# EAGLE schematic nixie_schema (EAGLE 8.2.1)

## Sheet 1 of 5: Tube Drivers
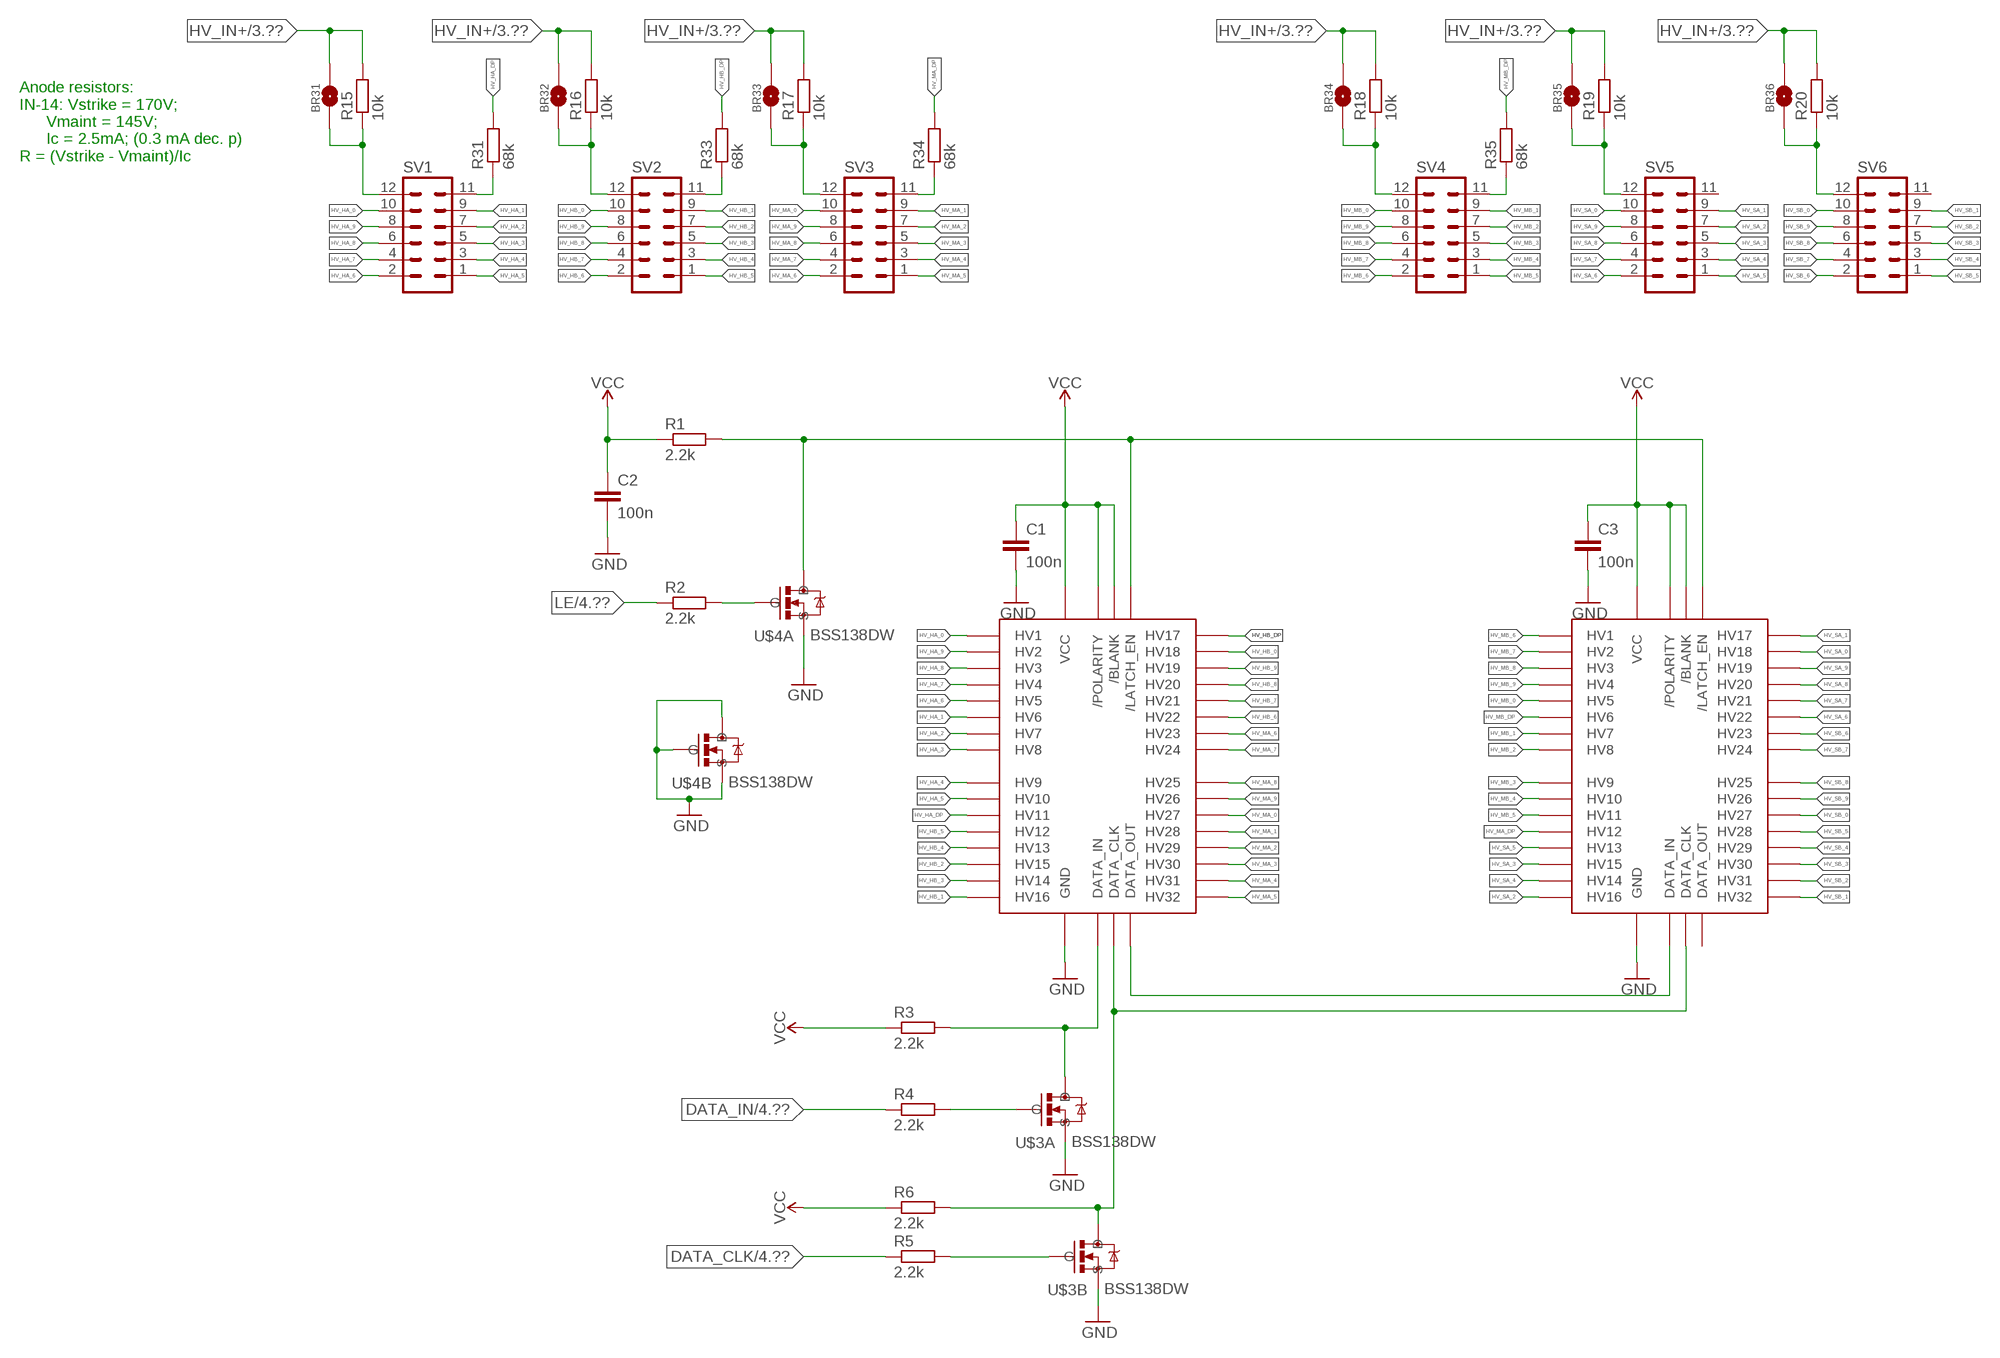
[diagram p0: schematic, sheet 1]

### Parts
BR31  HV_SOLDER_BRIDGE  [HV_SOLDER_BRIDGE]
BR32  HV_SOLDER_BRIDGE  [HV_SOLDER_BRIDGE]
BR33  HV_SOLDER_BRIDGE  [HV_SOLDER_BRIDGE]
BR34  HV_SOLDER_BRIDGE  [HV_SOLDER_BRIDGE]
BR35  HV_SOLDER_BRIDGE  [HV_SOLDER_BRIDGE]
BR36  HV_SOLDER_BRIDGE  [HV_SOLDER_BRIDGE]
C1  100n  C-EUC0805  [C0805]
C2  100n  C-EUC0805  [C0805]
C3  100n  C-EUC0805  [C0805]
R1  2.2k  R-EU_R0603  [R0603]
R2  2.2k  R-EU_R0603  [R0603]
R3  2.2k  R-EU_R0603  [R0603]
R4  2.2k  R-EU_R0603  [R0603]
R5  2.2k  R-EU_R0603  [R0603]
R6  2.2k  R-EU_R0603  [R0603]
R15  10k  R-EU_R0603  [R0603]
R16  10k  R-EU_R0603  [R0603]
R17  10k  R-EU_R0603  [R0603]
R18  10k  R-EU_R0603  [R0603]
R19  10k  R-EU_R0603  [R0603]
R20  10k  R-EU_R0603  [R0603]
R31  68k  R-EU_R0603  [R0603]
R33  68k  R-EU_R0603  [R0603]
R34  68k  R-EU_R0603  [R0603]
R35  68k  R-EU_R0603  [R0603]
SV1  MA06-2  [MA06-2]
SV2  MA06-2  [MA06-2]
SV3  MA06-2  [MA06-2]
SV4  MA06-2  [MA06-2]
SV5  MA06-2  [MA06-2]
SV6  MA06-2  [MA06-2]
U$1  HV5522  [CQFP-44]
U$2  HV5522  [CQFP-44]
U$3  BSS138DW  [SOT-363]
U$4  BSS138DW  [SOT-363]

### Nets
DATA_CLK: R5.1 ; also sheet 4
DATA_IN: R4.1 ; also sheet 4
GND: C1.2 C2.2 C3.2 U$1.24(GND) U$1.25(GND) U$1.26(GND) U$1.29(GND) U$1.34(GND) U$2.24(GND) U$2.25(GND) U$2.26(GND) U$2.29(GND) U$2.34(GND) U$3.1(A:S) U$3.4(B:S) U$4.1(A:S) U$4.3(B:D) U$4.4(B:S) U$4.5(B:G) ; also sheet 2,3,4,5
HV_DATA_CLK: R6.2 U$1.28(DATA_CLK) U$2.28(DATA_CLK) U$3.3(B:D)
HV_DATA_IN: R3.2 U$1.32(DATA_IN) U$3.6(A:D)
HV_DATA_OUT: U$1.23(DATA_OUT) U$2.32(DATA_IN)
HV_HA_0: SV1.10 U$1.35(HV1)
HV_HA_1: SV1.9 U$1.40(HV6)
HV_HA_2: SV1.7 U$1.41(HV7)
HV_HA_3: SV1.5 U$1.42(HV8)
HV_HA_4: SV1.3 U$1.43(HV9)
HV_HA_5: SV1.1 U$1.44(HV10)
HV_HA_6: SV1.2 U$1.39(HV5)
HV_HA_7: SV1.4 U$1.38(HV4)
HV_HA_8: SV1.6 U$1.37(HV3)
HV_HA_9: SV1.8 U$1.36(HV2)
HV_HA_DP: R31.2 U$1.1(HV11)
HV_HB_0: SV2.10 U$1.8(HV18)
HV_HB_1: SV2.9 U$1.6(HV16)
HV_HB_2: SV2.7 U$1.5(HV15)
HV_HB_3: SV2.5 U$1.4(HV14)
HV_HB_4: SV2.3 U$1.3(HV13)
HV_HB_5: SV2.1 U$1.2(HV12)
HV_HB_6: SV2.2 U$1.12(HV22)
HV_HB_7: SV2.4 U$1.11(HV21)
HV_HB_8: SV2.6 U$1.10(HV20)
HV_HB_9: SV2.8 U$1.9(HV19)
HV_HB_DP: R33.2 U$1.7(HV17)
HV_IN+ [HV]: BR31.P$2 BR32.P$2 BR33.P$2 BR34.P$2 BR35.P$2 BR36.P$2 R15.2 R16.2 R17.2 R18.2 R19.2 R20.2 ; also sheet 3
HV_LE: R1.2 U$1.31(/LATCH_EN) U$2.31(/LATCH_EN) U$4.6(A:D)
HV_MA_0: SV3.10 U$1.17(HV27)
HV_MA_1: SV3.9 U$1.18(HV28)
HV_MA_2: SV3.7 U$1.19(HV29)
HV_MA_3: SV3.5 U$1.20(HV30)
HV_MA_4: SV3.3 U$1.21(HV31)
HV_MA_5: SV3.1 U$1.22(HV32)
HV_MA_6: SV3.2 U$1.13(HV23)
HV_MA_7: SV3.4 U$1.14(HV24)
HV_MA_8: SV3.6 U$1.15(HV25)
HV_MA_9: SV3.8 U$1.16(HV26)
HV_MA_DP: R34.2 U$2.2(HV12)
HV_MB_0: SV4.10 U$2.39(HV5)
HV_MB_1: SV4.9 U$2.41(HV7)
HV_MB_2: SV4.7 U$2.42(HV8)
HV_MB_3: SV4.5 U$2.43(HV9)
HV_MB_4: SV4.3 U$2.44(HV10)
HV_MB_5: SV4.1 U$2.1(HV11)
HV_MB_6: SV4.2 U$2.35(HV1)
HV_MB_7: SV4.4 U$2.36(HV2)
HV_MB_8: SV4.6 U$2.37(HV3)
HV_MB_9: SV4.8 U$2.38(HV4)
HV_MB_DP: R35.2 U$2.40(HV6)
HV_SA_0: SV5.10 U$2.8(HV18)
HV_SA_1: SV5.9 U$2.7(HV17)
HV_SA_2: SV5.7 U$2.6(HV16)
HV_SA_3: SV5.5 U$2.5(HV15)
HV_SA_4: SV5.3 U$2.4(HV14)
HV_SA_5: SV5.1 U$2.3(HV13)
HV_SA_6: SV5.2 U$2.12(HV22)
HV_SA_7: SV5.4 U$2.11(HV21)
HV_SA_8: SV5.6 U$2.10(HV20)
HV_SA_9: SV5.8 U$2.9(HV19)
HV_SB_0: SV6.10 U$2.17(HV27)
HV_SB_1: SV6.9 U$2.22(HV32)
HV_SB_2: SV6.7 U$2.21(HV31)
HV_SB_3: SV6.5 U$2.20(HV30)
HV_SB_4: SV6.3 U$2.19(HV29)
HV_SB_5: SV6.1 U$2.18(HV28)
HV_SB_6: SV6.2 U$2.13(HV23)
HV_SB_7: SV6.4 U$2.14(HV24)
HV_SB_8: SV6.6 U$2.15(HV25)
HV_SB_9: SV6.8 U$2.16(HV26)
LE: R2.1 ; also sheet 4
N$3: R2.2 U$4.2(A:G)
N$4: R4.2 U$3.2(A:G)
N$8 [HV]: BR34.P$1 R18.1 SV4.12
N$9: R5.2 U$3.5(B:G)
N$11 [HV]: BR33.P$1 R17.1 SV3.12
N$89 [HV]: BR31.P$1 R15.1 SV1.12
N$90 [HV]: BR32.P$1 R16.1 SV2.12
N$91 [HV]: BR36.P$1 R20.1 SV6.12
N$92 [HV]: BR35.P$1 R19.1 SV5.12
N$106: R31.1 SV1.11
N$108: R33.1 SV2.11
N$110: R34.1 SV3.11
N$112: R35.1 SV4.11
VCC [Power]: C1.1 C2.1 C3.1 R1.1 R3.1 R6.1 U$1.27(/POLARITY) U$1.30(VCC) U$1.33(/BLANK) U$2.27(/POLARITY) U$2.30(VCC) U$2.33(/BLANK) ; also sheet 2,3
Unconnected: SV5.11 SV6.11 U$2.23(DATA_OUT)

### Notes on the sheet
- Anode resistors:
  IN-14: Vstrike = 170V;
        Vmaint = 145V;
        Ic = 2.5mA; (0.3 mA dec. p)
  R = (Vstrike - Vmaint)/Ic

## Sheet 2 of 5: Low Voltage Power Supply
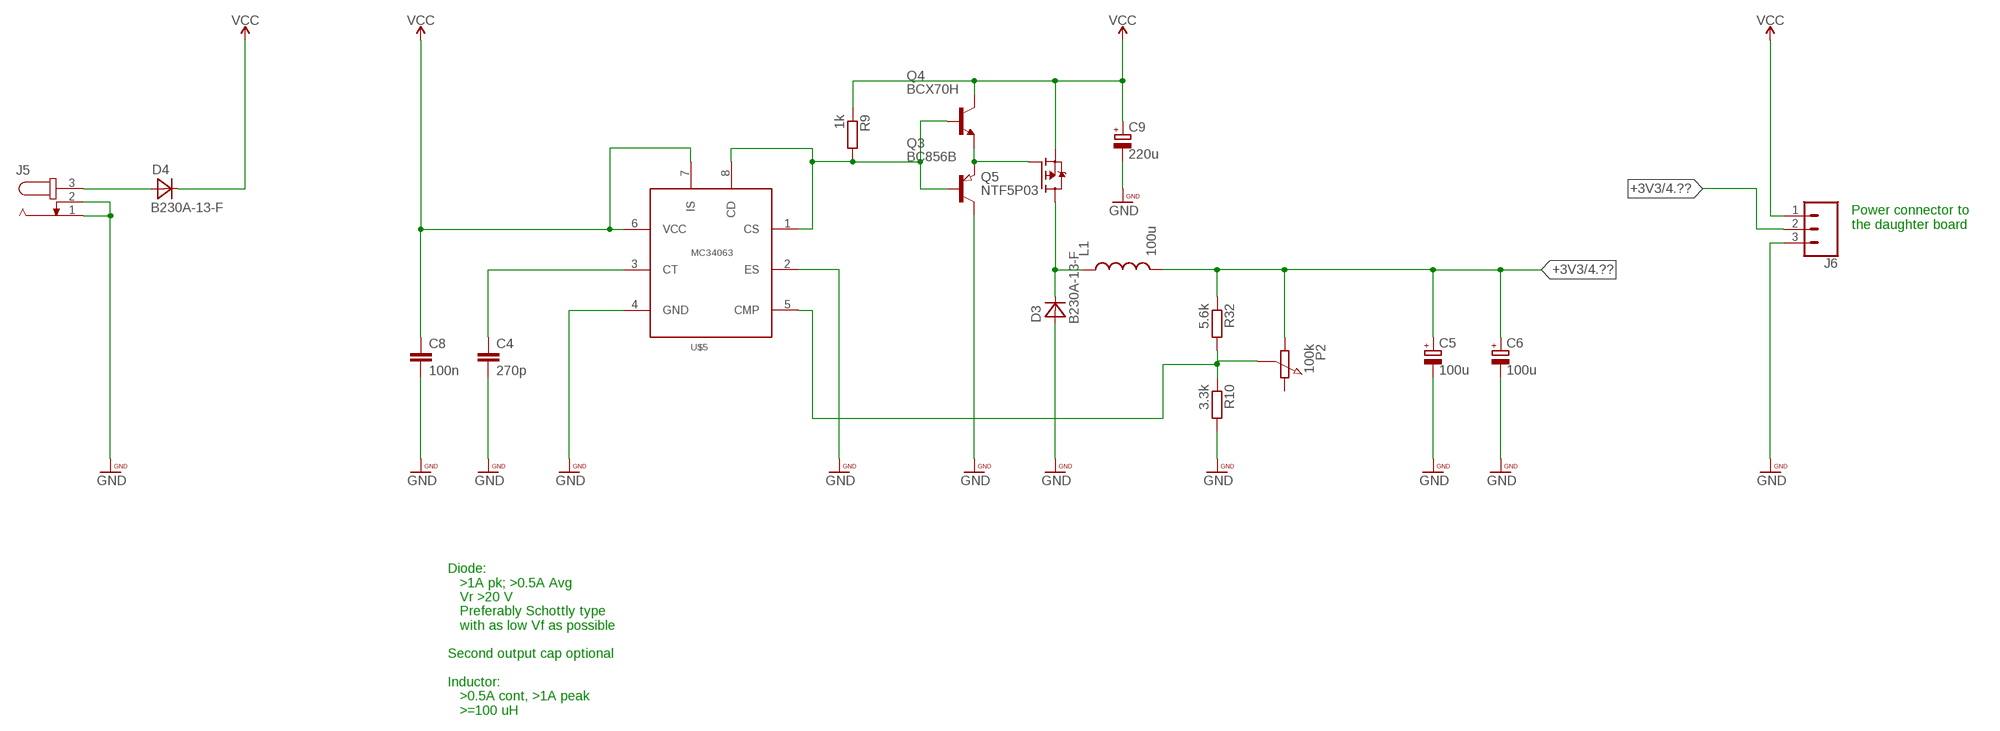
[diagram p1: schematic, sheet 2]

### Parts
C4  270p  C-EUC0805  [C0805]
C5  100u  CPOL-EU153CLV-1014  [153CLV-1014]
C6  100u  CPOL-EU153CLV-1014  [153CLV-1014]
C8  100n  C-EUC0805  [C0805]
C9  220u  CPOL-EU153CLV-1014  [153CLV-1014]
D3  B230A-13-F  [SMA/SMB]
D4  B230A-13-F  [SMA/SMB]
J5  JACK-PLUG0  [SPC4077]
J6  CONN_03  [1X03]
L1  100u  HM78D-128151KLFTR  [INDUCTOR_PACKAGE]
P2  100k  UNIVERSAL-POTENTIOMETER_SMD  [UNI_POT_SMD]
Q3  BC856B  [SOT23]
Q4  BCX70H  [SOT23]
Q5  NTF5P03  [SOT223]
R9  1k  R-EU_R0603  [R0603]
R10  3.3k  R-EU_R0603  [R0603]
R32  5.6k  R-EU_R0603  [R0603]
U$5  MC34063  [SOIC08]

### Nets
+3V3 [medium power]: C5.+ C6.+ J6.2 L1.P$2 P2.P$1(A) R32.1 ; also sheet 4
GND: C4.2 C5.- C6.- C8.2 C9.- D3.A J5.1 J5.2 J6.3 Q3.3(C) R10.2 U$5.2(ES) U$5.4(GND) ; also sheet 1,3,4,5
N$5: Q3.1(B) Q4.1(B) R9.2 U$5.1(CS) U$5.8(CD)
N$12: C4.1 U$5.3(CT)
N$13 [medium power]: D3.C L1.P$1 Q5.2(D) Q5.4(D)
N$93 [Power]: D4.A J5.3
N$102: Q3.2(E) Q4.2(E) Q5.1(G)
N$103: P2.P$2(WIPER) R10.1 R32.2 U$5.5(CMP)
VCC [Power]: C8.1 C9.+ D4.C J6.1 Q4.3(C) Q5.3(S) R9.1 U$5.6(VCC) U$5.7(IS) ; also sheet 1,3
Unconnected: P2.P$3(E)

### Notes on the sheet
- Power connector to
  the daughter board
- Diode:
     >1A pk; >0.5A Avg
     Vr >20 V
     Preferably Schottly type
     with as low Vf as possible
  
  Second output cap optional
  
  Inductor:
     >0.5A cont, >1A peak
     >=100 uH

## Sheet 3 of 5: High Voltage Power Supply
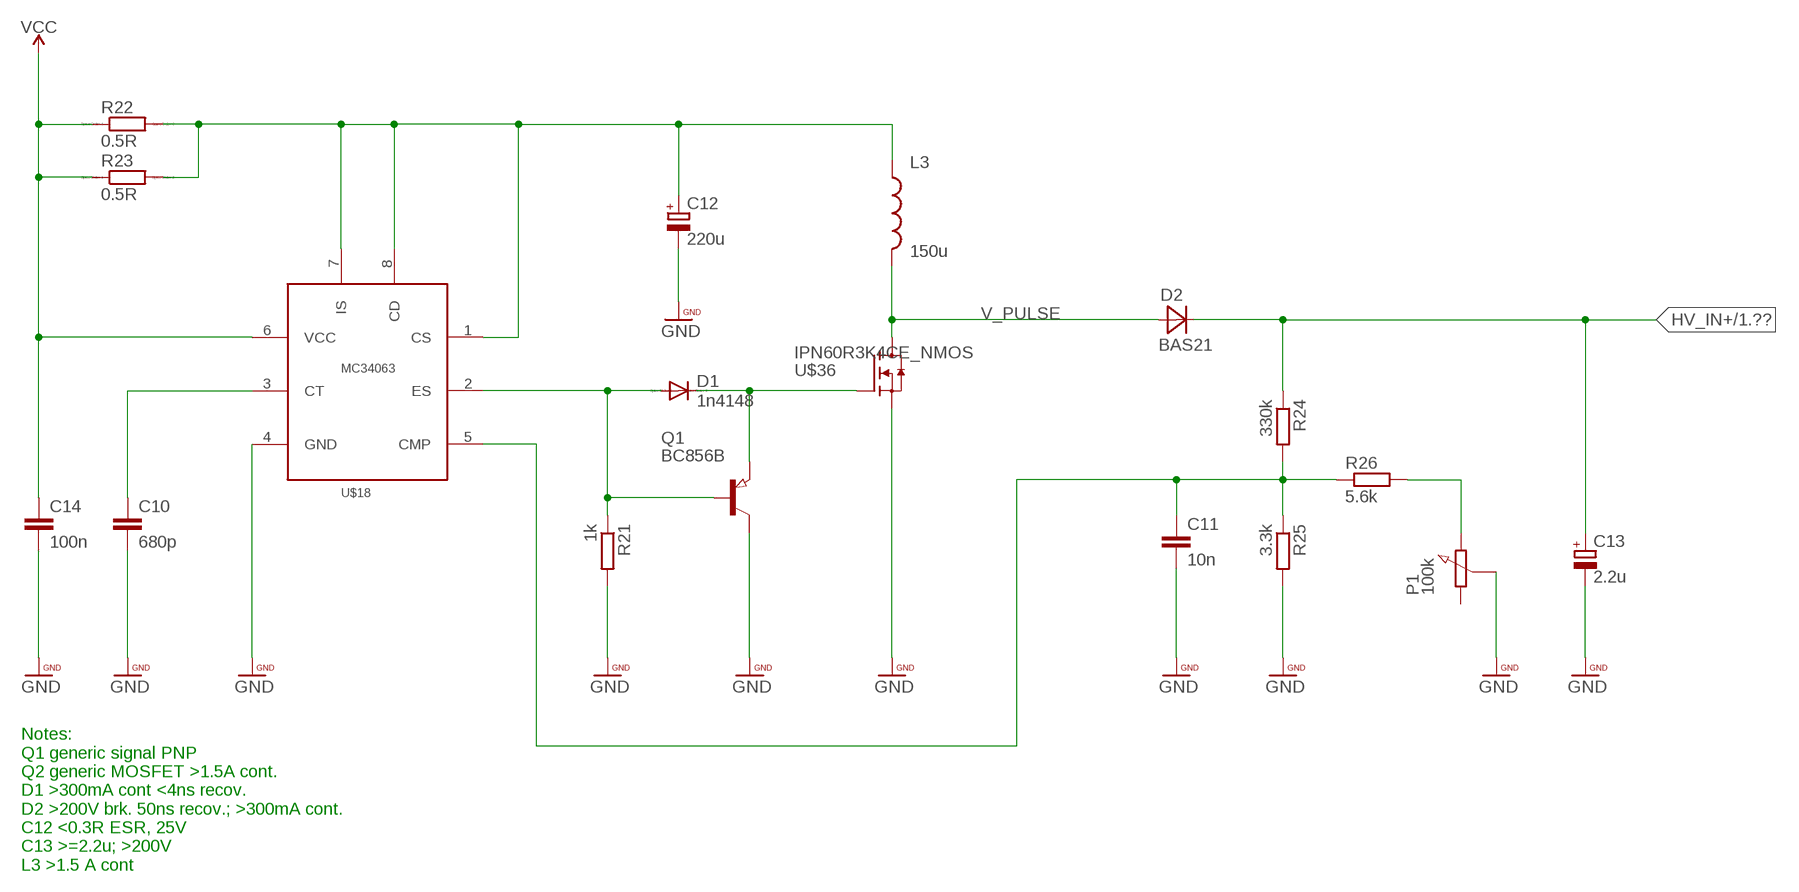
[diagram p2: schematic, sheet 3]

### Parts
C10  680p  C-EUC0805  [C0805]
C11  10n  C-EUC0805  [C0805]
C12  220u  CPOL-EU153CLV-1014  [153CLV-1014]
C13  2.2u  CPOL-EU153CLV-1014  [153CLV-1014]
C14  100n  C-EUC0805  [C0805]
D1  1n4148  DIODE-SOD123  [SOD123]
D2  BAS21  [SOT23]
L3  150u  HM78D-128151KLFTR  [INDUCTOR_PACKAGE]
P1  100k  UNIVERSAL-POTENTIOMETER_SMD  [UNI_POT_SMD]
Q1  BC856B  [SOT23]
R21  1k  R-EU_R0603  [R0603]
R22  0.5R  RR1210  [R1210]
R23  0.5R  RR1210  [R1210]
R24  330k  R-EU_R0603  [R0603]
R25  3.3k  R-EU_R0603  [R0603]
R26  5.6k  R-EU_R0603  [R0603]
U$18  MC34063  [SOIC08]
U$36  IPN60R3K4CE_NMOS  [SOT223]

### Nets
GND: C10.2 C11.2 C12.- C13.- C14.2 P1.P$2(WIPER) Q1.3(C) R21.2 R25.2 U$18.4(GND) U$36.3(S) ; also sheet 1,2,4,5
HV_IN+ [HV]: C13.+ D2.3(C) R24.1 ; also sheet 1
N$74: C10.1 U$18.3(CT)
N$85: D1.A Q1.1(B) R21.1 U$18.2(ES)
N$87 [Power]: C12.+ L3.P$1 R22.2 R23.2 U$18.1(CS) U$18.7(IS) U$18.8(CD)
N$95: D1.C Q1.2(E) U$36.1(G)
N$96: C11.1 R24.2 R25.1 R26.1 U$18.5(CMP)
N$97: P1.P$3(E) R26.2
V_PULSE [HV]: D2.1(A) L3.P$2 U$36.2(D) U$36.4(D)
VCC [Power]: C14.1 R22.1 R23.1 U$18.6(VCC) ; also sheet 1,2
Unconnected: P1.P$1(A)

### Notes on the sheet
- Notes:
  Q1 generic signal PNP
  Q2 generic MOSFET >1.5A cont.
  D1 >300mA cont <4ns recov.
  D2 >200V brk. 50ns recov.; >300mA cont.
  C12 <0.3R ESR, 25V
  C13 >=2.2u; >200V
  L3 >1.5 A cont

## Sheet 4 of 5: ESP8266 Controller
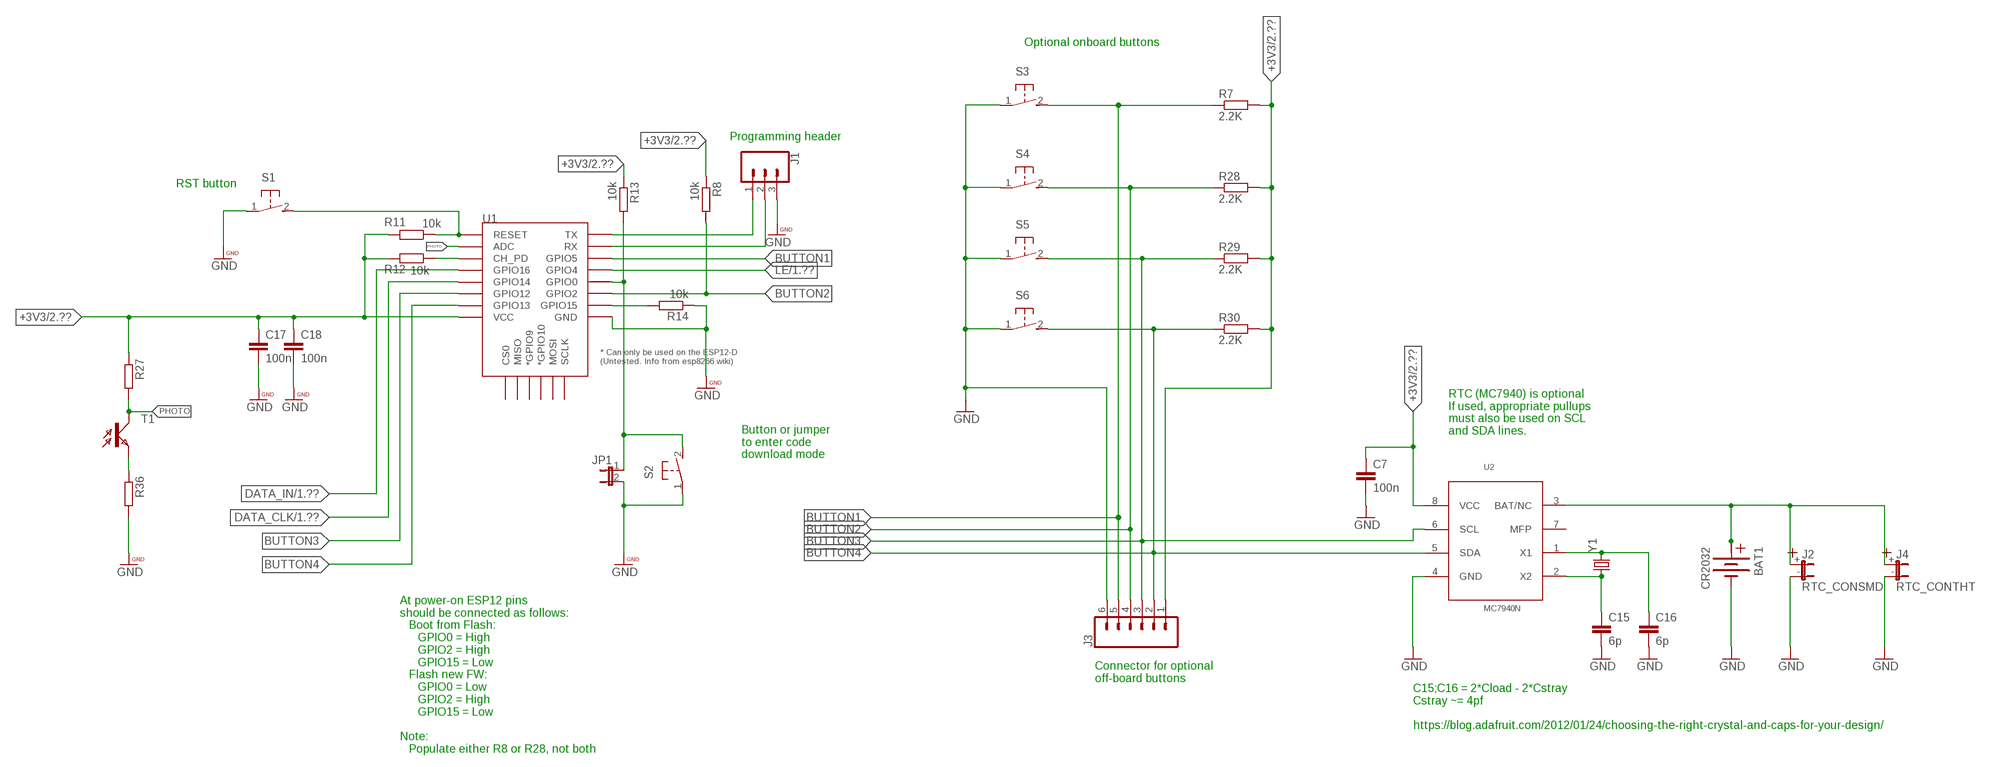
[diagram p3: schematic, sheet 4]

### Parts
BAT1  CR2032  [CR2032]
C7  100n  C-EUC0805  [C0805]
C15  6p  C-EUC0805  [C0805]
C16  6p  C-EUC0805  [C0805]
C17  100n  C-EUC0805  [C0805]
C18  100n  C-EUC0805  [C0805]
J1  CONN_03  [1X03]
J2  RTC_CONSMD  [PICOBLADE_SMD_2]
J3  CONN_06NO_SILK_FEMALE_PTH  [1X06_NO_SILK]
J4  RTC_CONTHT  [PICOBLADE_THT_2]
JP1  JUMPER2  [JUMPER2]
R7  2.2K  R-EU_R0603  [R0603]
R8  10k  R-EU_R0603  [R0603]
R11  10k  R-EU_R0603  [R0603]
R12  10k  R-EU_R0603  [R0603]
R13  10k  R-EU_R0603  [R0603]
R14  10k  R-EU_R0603  [R0603]
R27  R-EU_R0603  [R0603]
R28  2.2K  R-EU_R0603  [R0603]
R29  2.2K  R-EU_R0603  [R0603]
R30  2.2K  R-EU_R0603  [R0603]
R36  R-EU_R0603  [R0603]
S1  31-XX  [B3F-31XX]
S2  31-XX  [B3F-31XX]
S3  31-XX  [B3F-31XX]
S4  31-XX  [B3F-31XX]
S5  31-XX  [B3F-31XX]
S6  31-XX  [B3F-31XX]
T1  PHOTO_TRANS  [C0805K]
U1  ESP12ESMD  [ESP12E-SMD]
U2  MC7940N  [SOIC8-N_MC]
Y1  ECS-.327-7-34B  [CRYSTAL_PACK]

### Nets
+3V3 [medium power]: C7.1 C17.1 C18.1 J3.1 R7.2 R8.1 R11.2 R12.2 R13.1 R27.1 R28.2 R29.2 R30.2 U1.VCC U2.8(VCC) ; also sheet 2
BUTTON1: J3.5 R7.1 S3.2(S) U1.GPIO5
BUTTON2: J3.4 R8.2 R28.1 S4.2(S) U1.GPIO2
BUTTON3: J3.3 R29.1 S5.2(S) U1.GPIO12 U2.6(SCL)
BUTTON4: J3.2 R30.1 S6.2(S) U1.GPIO13 U2.5(SDA)
DATA_CLK: U1.GPIO14 ; also sheet 1
DATA_IN: U1.GPIO16 ; also sheet 1
GND: BAT1.- C7.2 C15.2 C16.2 C17.2 C18.2 J1.3 J2.- J3.6 J4.- JP1.2 R14.1 R36.2 S1.1(P) S2.1(P) S3.1(P) S4.1(P) S5.1(P) S6.1(P) U1.GND U2.4(GND) ; also sheet 1,2,3,5
LE: U1.GPIO4 ; also sheet 1
N$14: R11.1 S1.2(S) U1.RESET
N$15: JP1.1 R13.2 S2.2(S) U1.GPIO0
N$16: R12.1 U1.CH_PD
N$17: J1.1 U1.TXD0(TX)
N$18: J1.2 U1.RXD0(RX)
N$20: R14.2 U1.GPIO15
N$22 [medium power]: BAT1.+_1(+) J2.+ J4.+ U2.3(BAT/NC)
N$99: C16.1 U2.1(X1) Y1.P$2
N$100: C15.1 U2.2(X2) Y1.P$1
N$109: R36.1 T1.EMI(E)
PHOTO: R27.2 T1.COL(C) U1.ADC
Unconnected: U1.CS0 U1.GPIO9(*GPIO9) U1.GPIO10(*GPIO10) U1.MISO U1.MOSI U1.SCLK U2.7(MFP)

### Notes on the sheet
- Optional onboard buttons
- Programming header
- RST button
- RTC (MC7940) is optional
  If used, appropriate pullups
  must also be used on SCL
  and SDA lines.
- Button or jumper
  to enter code
  download mode
- Connector for optional
  off-board buttons
- C15;C16 = 2*Cload - 2*Cstray
  Cstray ~= 4pf
  
  https://blog.adafruit.com/2012/01/24/choosing-the-right-crystal-and-caps-for-your-design/
- At power-on ESP12 pins
  should be connected as follows:
     Boot from Flash:
        GPIO0 = High
        GPIO2 = High
        GPIO15 = Low
     Flash new FW:
        GPIO0 = Low
        GPIO2 = High
        GPIO15 = Low
  
  Note:
     Populate either R8 or R28, not both

## Sheet 5 of 5: Daugther board for Tubes
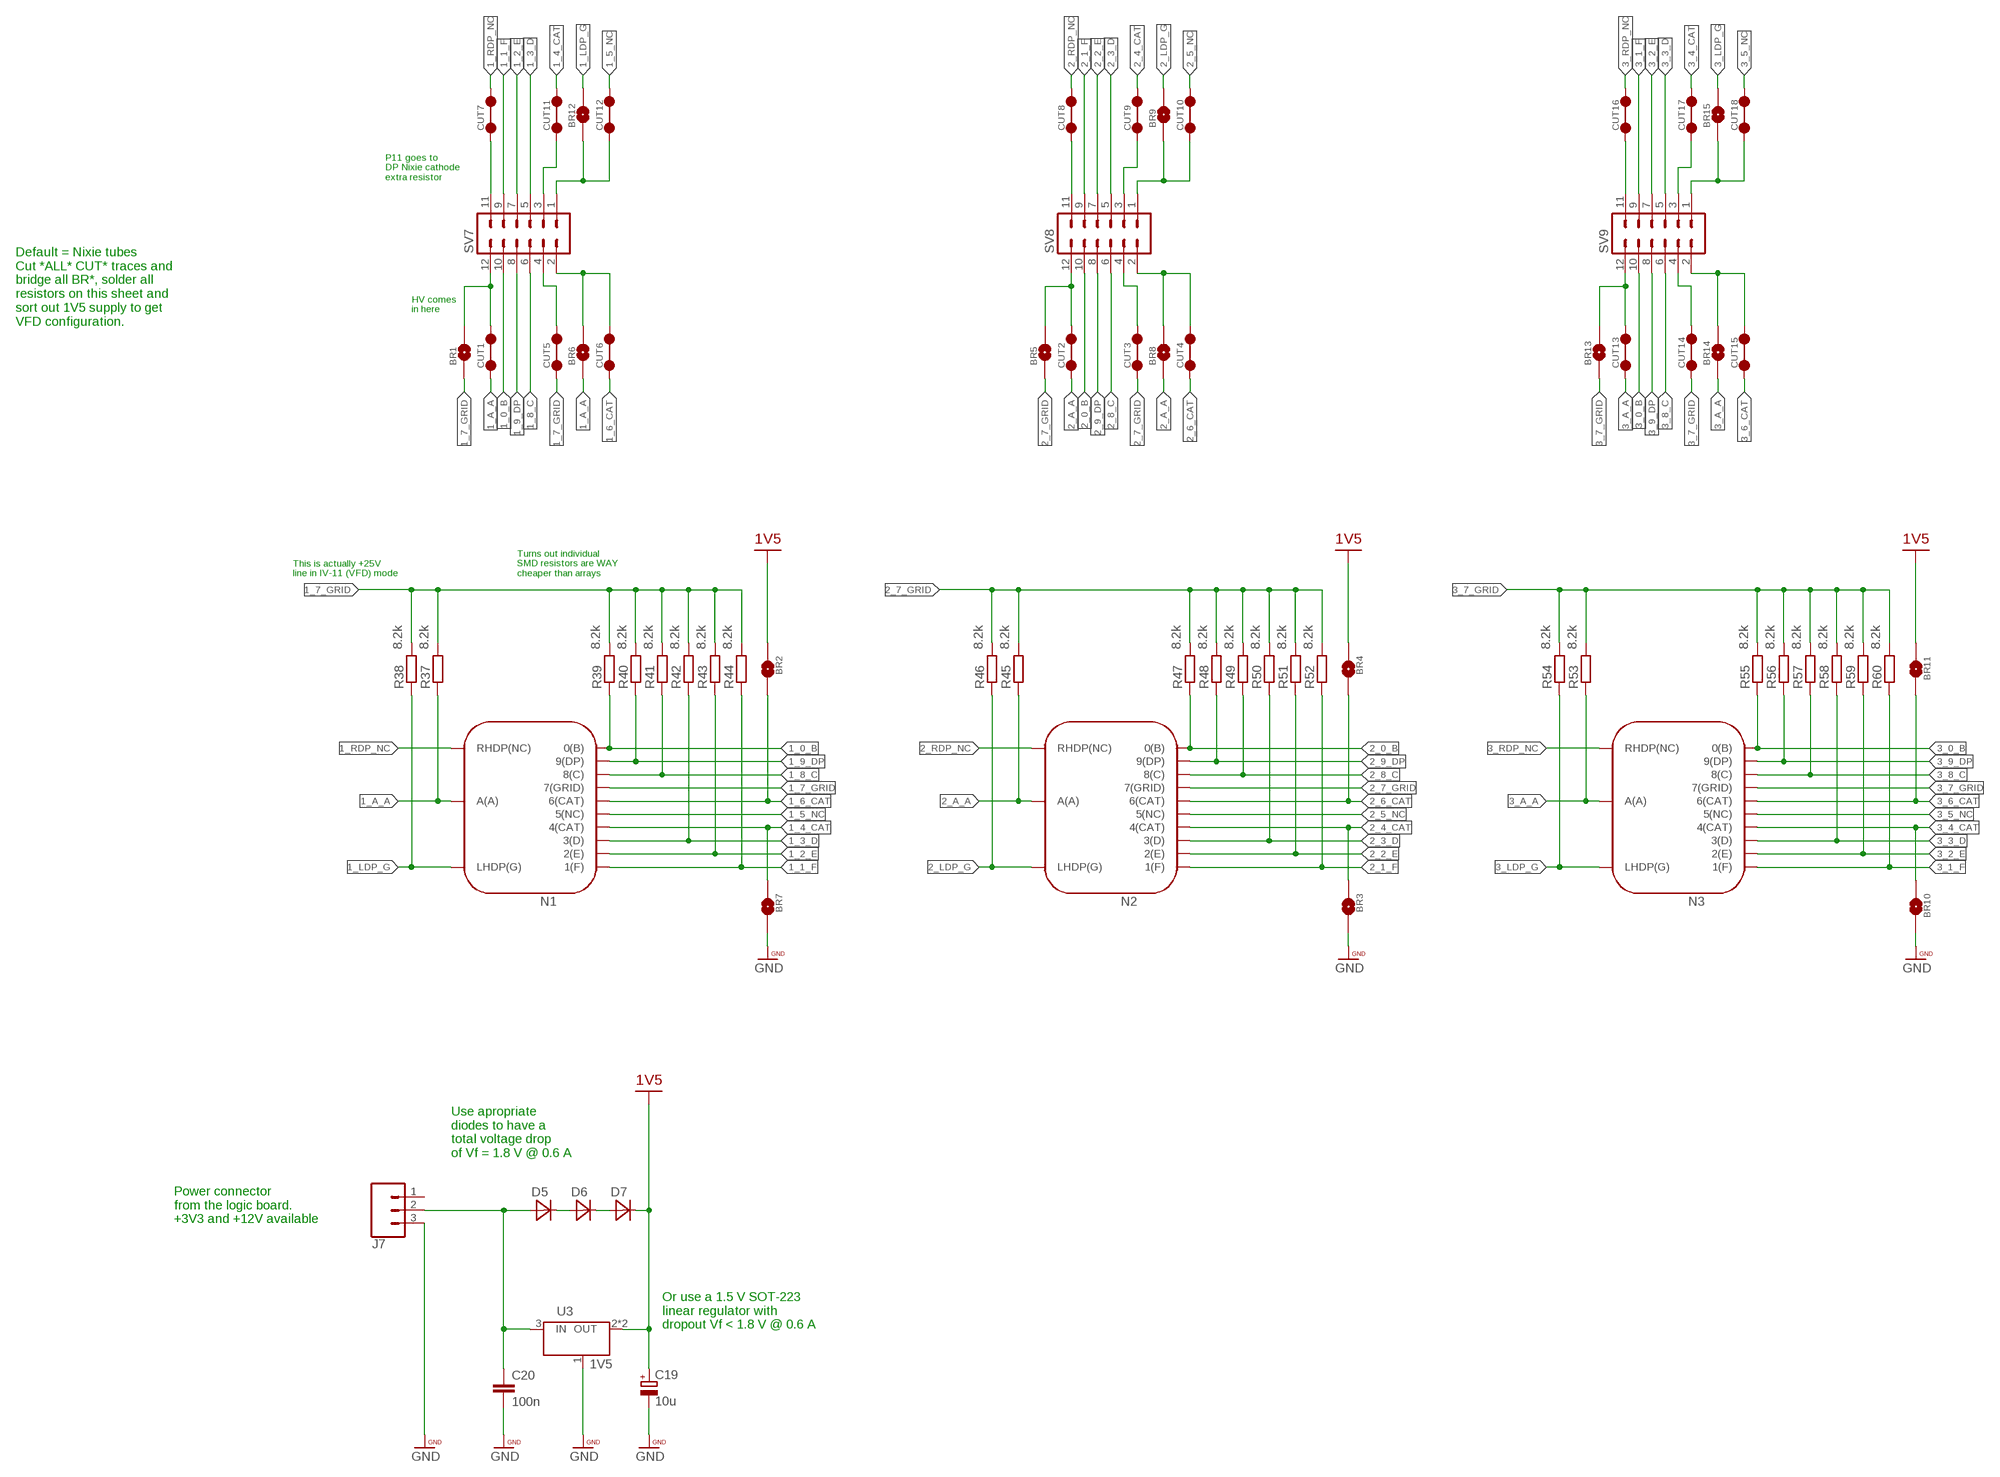
[diagram p4: schematic, sheet 5, part 1 of 2]
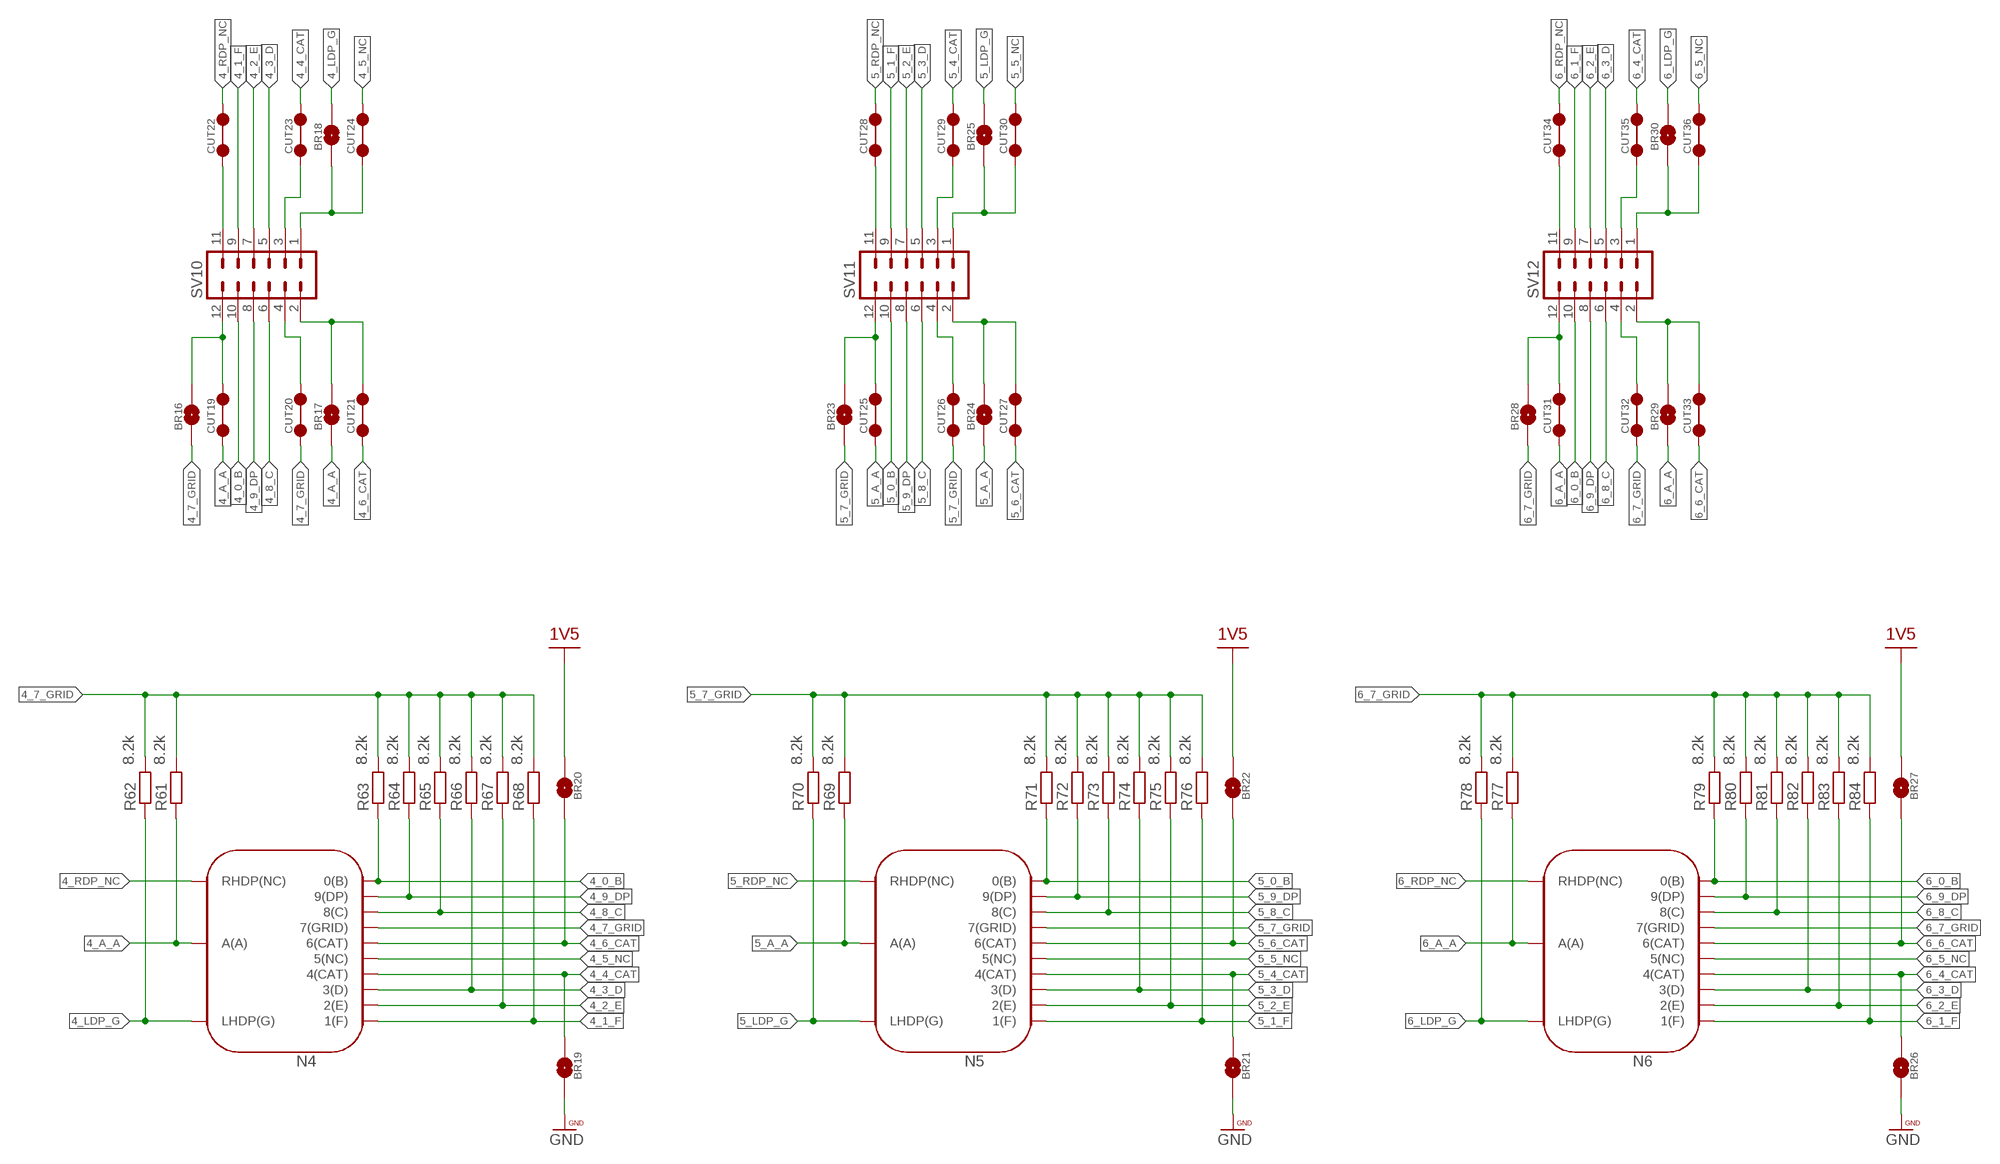
[diagram p5: schematic, sheet 5, part 2 of 2]

### Parts
BR1  HV_SOLDER_BRIDGE  [HV_SOLDER_BRIDGE]
BR2  HV_SOLDER_BRIDGE  [HV_SOLDER_BRIDGE]
BR3  HV_SOLDER_BRIDGE  [HV_SOLDER_BRIDGE]
BR4  HV_SOLDER_BRIDGE  [HV_SOLDER_BRIDGE]
BR5  HV_SOLDER_BRIDGE  [HV_SOLDER_BRIDGE]
BR6  HV_SOLDER_BRIDGE  [HV_SOLDER_BRIDGE]
BR7  HV_SOLDER_BRIDGE  [HV_SOLDER_BRIDGE]
BR8  HV_SOLDER_BRIDGE  [HV_SOLDER_BRIDGE]
BR9  HV_SOLDER_BRIDGE  [HV_SOLDER_BRIDGE]
BR10  HV_SOLDER_BRIDGE  [HV_SOLDER_BRIDGE]
BR11  HV_SOLDER_BRIDGE  [HV_SOLDER_BRIDGE]
BR12  HV_SOLDER_BRIDGE  [HV_SOLDER_BRIDGE]
BR13  HV_SOLDER_BRIDGE  [HV_SOLDER_BRIDGE]
BR14  HV_SOLDER_BRIDGE  [HV_SOLDER_BRIDGE]
BR15  HV_SOLDER_BRIDGE  [HV_SOLDER_BRIDGE]
BR16  HV_SOLDER_BRIDGE  [HV_SOLDER_BRIDGE]
BR17  HV_SOLDER_BRIDGE  [HV_SOLDER_BRIDGE]
BR18  HV_SOLDER_BRIDGE  [HV_SOLDER_BRIDGE]
BR19  HV_SOLDER_BRIDGE  [HV_SOLDER_BRIDGE]
BR20  HV_SOLDER_BRIDGE  [HV_SOLDER_BRIDGE]
BR21  HV_SOLDER_BRIDGE  [HV_SOLDER_BRIDGE]
BR22  HV_SOLDER_BRIDGE  [HV_SOLDER_BRIDGE]
BR23  HV_SOLDER_BRIDGE  [HV_SOLDER_BRIDGE]
BR24  HV_SOLDER_BRIDGE  [HV_SOLDER_BRIDGE]
BR25  HV_SOLDER_BRIDGE  [HV_SOLDER_BRIDGE]
BR26  HV_SOLDER_BRIDGE  [HV_SOLDER_BRIDGE]
BR27  HV_SOLDER_BRIDGE  [HV_SOLDER_BRIDGE]
BR28  HV_SOLDER_BRIDGE  [HV_SOLDER_BRIDGE]
BR29  HV_SOLDER_BRIDGE  [HV_SOLDER_BRIDGE]
BR30  HV_SOLDER_BRIDGE  [HV_SOLDER_BRIDGE]
C19  10u  CPOL-EU153CLV-1014  [153CLV-1014]
C20  100n  C-EUC0805  [C0805]
CUT1  CUT_TRACE  [CUT_TRACE_2]
CUT2  CUT_TRACE  [CUT_TRACE_2]
CUT3  CUT_TRACE  [CUT_TRACE_2]
CUT4  CUT_TRACE  [CUT_TRACE_2]
CUT5  CUT_TRACE  [CUT_TRACE_2]
CUT6  CUT_TRACE  [CUT_TRACE_2]
CUT7  CUT_TRACE  [CUT_TRACE_2]
CUT8  CUT_TRACE  [CUT_TRACE_2]
CUT9  CUT_TRACE  [CUT_TRACE_2]
CUT10  CUT_TRACE  [CUT_TRACE_2]
CUT11  CUT_TRACE  [CUT_TRACE_2]
CUT12  CUT_TRACE  [CUT_TRACE_2]
CUT13  CUT_TRACE  [CUT_TRACE_2]
CUT14  CUT_TRACE  [CUT_TRACE_2]
CUT15  CUT_TRACE  [CUT_TRACE_2]
CUT16  CUT_TRACE  [CUT_TRACE_2]
CUT17  CUT_TRACE  [CUT_TRACE_2]
CUT18  CUT_TRACE  [CUT_TRACE_2]
CUT19  CUT_TRACE  [CUT_TRACE_2]
CUT20  CUT_TRACE  [CUT_TRACE_2]
CUT21  CUT_TRACE  [CUT_TRACE_2]
CUT22  CUT_TRACE  [CUT_TRACE_2]
CUT23  CUT_TRACE  [CUT_TRACE_2]
CUT24  CUT_TRACE  [CUT_TRACE_2]
CUT25  CUT_TRACE  [CUT_TRACE_2]
CUT26  CUT_TRACE  [CUT_TRACE_2]
CUT27  CUT_TRACE  [CUT_TRACE_2]
CUT28  CUT_TRACE  [CUT_TRACE_2]
CUT29  CUT_TRACE  [CUT_TRACE_2]
CUT30  CUT_TRACE  [CUT_TRACE_2]
CUT31  CUT_TRACE  [CUT_TRACE_2]
CUT32  CUT_TRACE  [CUT_TRACE_2]
CUT33  CUT_TRACE  [CUT_TRACE_2]
CUT34  CUT_TRACE  [CUT_TRACE_2]
CUT35  CUT_TRACE  [CUT_TRACE_2]
CUT36  CUT_TRACE  [CUT_TRACE_2]
D5  B230A-13-F  [SMA/SMB]
D6  B230A-13-F  [SMA/SMB]
D7  B230A-13-F  [SMA/SMB]
J7  CONN_03  [1X03]
N1  IN-14_IV-11_COMBI  [IN-14_IV-11]
N2  IN-14_IV-11_COMBI  [IN-14_IV-11]
N3  IN-14_IV-11_COMBI  [IN-14_IV-11]
N4  IN-14_IV-11_COMBI  [IN-14_IV-11]
N5  IN-14_IV-11_COMBI  [IN-14_IV-11]
N6  IN-14_IV-11_COMBI  [IN-14_IV-11]
R37  8.2k  R-EU_R0603  [R0603]
R38  8.2k  R-EU_R0603  [R0603]
R39  8.2k  R-EU_R0603  [R0603]
R40  8.2k  R-EU_R0603  [R0603]
R41  8.2k  R-EU_R0603  [R0603]
R42  8.2k  R-EU_R0603  [R0603]
R43  8.2k  R-EU_R0603  [R0603]
R44  8.2k  R-EU_R0603  [R0603]
R45  8.2k  R-EU_R0603  [R0603]
R46  8.2k  R-EU_R0603  [R0603]
R47  8.2k  R-EU_R0603  [R0603]
R48  8.2k  R-EU_R0603  [R0603]
R49  8.2k  R-EU_R0603  [R0603]
R50  8.2k  R-EU_R0603  [R0603]
R51  8.2k  R-EU_R0603  [R0603]
R52  8.2k  R-EU_R0603  [R0603]
R53  8.2k  R-EU_R0603  [R0603]
R54  8.2k  R-EU_R0603  [R0603]
R55  8.2k  R-EU_R0603  [R0603]
R56  8.2k  R-EU_R0603  [R0603]
R57  8.2k  R-EU_R0603  [R0603]
R58  8.2k  R-EU_R0603  [R0603]
R59  8.2k  R-EU_R0603  [R0603]
R60  8.2k  R-EU_R0603  [R0603]
R61  8.2k  R-EU_R0603  [R0603]
R62  8.2k  R-EU_R0603  [R0603]
R63  8.2k  R-EU_R0603  [R0603]
R64  8.2k  R-EU_R0603  [R0603]
R65  8.2k  R-EU_R0603  [R0603]
R66  8.2k  R-EU_R0603  [R0603]
R67  8.2k  R-EU_R0603  [R0603]
R68  8.2k  R-EU_R0603  [R0603]
R69  8.2k  R-EU_R0603  [R0603]
R70  8.2k  R-EU_R0603  [R0603]
R71  8.2k  R-EU_R0603  [R0603]
R72  8.2k  R-EU_R0603  [R0603]
R73  8.2k  R-EU_R0603  [R0603]
R74  8.2k  R-EU_R0603  [R0603]
R75  8.2k  R-EU_R0603  [R0603]
R76  8.2k  R-EU_R0603  [R0603]
R77  8.2k  R-EU_R0603  [R0603]
R78  8.2k  R-EU_R0603  [R0603]
R79  8.2k  R-EU_R0603  [R0603]
R80  8.2k  R-EU_R0603  [R0603]
R81  8.2k  R-EU_R0603  [R0603]
R82  8.2k  R-EU_R0603  [R0603]
R83  8.2k  R-EU_R0603  [R0603]
R84  8.2k  R-EU_R0603  [R0603]
SV7  MA06-2  [MA06-2]
SV8  MA06-2  [MA06-2]
SV9  MA06-2  [MA06-2]
SV10  MA06-2  [MA06-2]
SV11  MA06-2  [MA06-2]
SV12  MA06-2  [MA06-2]
U3  1V5  VREG  [SOT223]

### Nets
1_0_B: N1.0(B) R39.1 SV7.10
1_1_F: N1.1(F) R44.1 SV7.9
1_2_E: N1.2(E) R43.1 SV7.7
1_3_D: N1.3(D) R42.1 SV7.5
1_4_CAT: BR7.P$1 CUT11.P$2 N1.4(CAT)
1_5_NC: CUT12.P$2 N1.5(NC)
1_6_CAT: BR2.P$2 CUT6.P$1 N1.6(CAT)
1_7_GRID: BR1.P$1 CUT5.P$1 N1.7(GRID) R37.2 R38.2 R39.2 R40.2 R41.2 R42.2 R43.2 R44.2
1_8_C: N1.8(C) R41.1 SV7.6
1_9_DP: N1.9(DP) R40.1 SV7.8
1_A_A [HV]: BR6.P$1 CUT1.P$1 N1.A(A) R37.1
1_LDP_G: BR12.P$2 N1.LHDP(G) R38.1
1_RDP_NC: CUT7.P$2 N1.RHDP(NC)
1V5 [medium power]: BR2.P$1 BR4.P$1 BR11.P$1 BR20.P$1 BR22.P$1 BR27.P$1 C19.+ D7.C U3.2(OUT) U3.4(OUT)
2_0_B: N2.0(B) R47.1 SV8.10
2_1_F: N2.1(F) R52.1 SV8.9
2_2_E: N2.2(E) R51.1 SV8.7
2_3_D: N2.3(D) R50.1 SV8.5
2_4_CAT: BR3.P$1 CUT9.P$2 N2.4(CAT)
2_5_NC: CUT10.P$2 N2.5(NC)
2_6_CAT: BR4.P$2 CUT4.P$1 N2.6(CAT)
2_7_GRID: BR5.P$1 CUT3.P$1 N2.7(GRID) R45.2 R46.2 R47.2 R48.2 R49.2 R50.2 R51.2 R52.2
2_8_C: N2.8(C) R49.1 SV8.6
2_9_DP: N2.9(DP) R48.1 SV8.8
2_A_A [HV]: BR8.P$1 CUT2.P$1 N2.A(A) R45.1
2_LDP_G: BR9.P$2 N2.LHDP(G) R46.1
2_RDP_NC: CUT8.P$2 N2.RHDP(NC)
3_0_B: N3.0(B) R55.1 SV9.10
3_1_F: N3.1(F) R60.1 SV9.9
3_2_E: N3.2(E) R59.1 SV9.7
3_3_D: N3.3(D) R58.1 SV9.5
3_4_CAT: BR10.P$1 CUT17.P$2 N3.4(CAT)
3_5_NC: CUT18.P$2 N3.5(NC)
3_6_CAT: BR11.P$2 CUT15.P$1 N3.6(CAT)
3_7_GRID: BR13.P$1 CUT14.P$1 N3.7(GRID) R53.2 R54.2 R55.2 R56.2 R57.2 R58.2 R59.2 R60.2
3_8_C: N3.8(C) R57.1 SV9.6
3_9_DP: N3.9(DP) R56.1 SV9.8
3_A_A [HV]: BR14.P$1 CUT13.P$1 N3.A(A) R53.1
3_LDP_G: BR15.P$2 N3.LHDP(G) R54.1
3_RDP_NC: CUT16.P$2 N3.RHDP(NC)
4_0_B: N4.0(B) R63.1 SV10.10
4_1_F: N4.1(F) R68.1 SV10.9
4_2_E: N4.2(E) R67.1 SV10.7
4_3_D: N4.3(D) R66.1 SV10.5
4_4_CAT: BR19.P$1 CUT23.P$2 N4.4(CAT)
4_5_NC: CUT24.P$2 N4.5(NC)
4_6_CAT: BR20.P$2 CUT21.P$1 N4.6(CAT)
4_7_GRID: BR16.P$1 CUT20.P$1 N4.7(GRID) R61.2 R62.2 R63.2 R64.2 R65.2 R66.2 R67.2 R68.2
4_8_C: N4.8(C) R65.1 SV10.6
4_9_DP: N4.9(DP) R64.1 SV10.8
4_A_A [HV]: BR17.P$1 CUT19.P$1 N4.A(A) R61.1
4_LDP_G: BR18.P$2 N4.LHDP(G) R62.1
4_RDP_NC: CUT22.P$2 N4.RHDP(NC)
5_0_B: N5.0(B) R71.1 SV11.10
5_1_F: N5.1(F) R76.1 SV11.9
5_2_E: N5.2(E) R75.1 SV11.7
5_3_D: N5.3(D) R74.1 SV11.5
5_4_CAT: BR21.P$1 CUT29.P$2 N5.4(CAT)
5_5_NC: CUT30.P$2 N5.5(NC)
5_6_CAT: BR22.P$2 CUT27.P$1 N5.6(CAT)
5_7_GRID: BR23.P$1 CUT26.P$1 N5.7(GRID) R69.2 R70.2 R71.2 R72.2 R73.2 R74.2 R75.2 R76.2
5_8_C: N5.8(C) R73.1 SV11.6
5_9_DP: N5.9(DP) R72.1 SV11.8
5_A_A [HV]: BR24.P$1 CUT25.P$1 N5.A(A) R69.1
5_LDP_G: BR25.P$2 N5.LHDP(G) R70.1
5_RDP_NC: CUT28.P$2 N5.RHDP(NC)
6_0_B: N6.0(B) R79.1 SV12.10
6_1_F: N6.1(F) R84.1 SV12.9
6_2_E: N6.2(E) R83.1 SV12.7
6_3_D: N6.3(D) R82.1 SV12.5
6_4_CAT: BR26.P$1 CUT35.P$2 N6.4(CAT)
6_5_NC: CUT36.P$2 N6.5(NC)
6_6_CAT: BR27.P$2 CUT33.P$1 N6.6(CAT)
6_7_GRID: BR28.P$1 CUT32.P$1 N6.7(GRID) R77.2 R78.2 R79.2 R80.2 R81.2 R82.2 R83.2 R84.2
6_8_C: N6.8(C) R81.1 SV12.6
6_9_DP: N6.9(DP) R80.1 SV12.8
6_A_A [HV]: BR29.P$1 CUT31.P$1 N6.A(A) R77.1
6_LDP_G: BR30.P$2 N6.LHDP(G) R78.1
6_RDP_NC: CUT34.P$2 N6.RHDP(NC)
GND: BR3.P$2 BR7.P$2 BR10.P$2 BR19.P$2 BR21.P$2 BR26.P$2 C19.- C20.2 J7.3 U3.1(GND/ADJ) ; also sheet 1,2,3,4
N$1 [HV]: BR5.P$2 CUT2.P$2 SV8.12
N$2 [HV]: BR1.P$2 CUT1.P$2 SV7.12
N$6: BR8.P$2 CUT4.P$2 SV8.2
N$7: CUT3.P$2 SV8.4
N$10: BR6.P$2 CUT6.P$2 SV7.2
N$19: CUT8.P$1 SV8.11
N$21 [HV]: BR13.P$2 CUT13.P$2 SV9.12
N$23: BR9.P$1 CUT10.P$1 SV8.1
N$24: CUT5.P$2 SV7.4
N$25: CUT9.P$1 SV8.3
N$26: CUT7.P$1 SV7.11
N$27: BR14.P$2 CUT15.P$2 SV9.2
N$28: CUT14.P$2 SV9.4
N$29: BR12.P$1 CUT12.P$1 SV7.1
N$30: CUT11.P$1 SV7.3
N$31: CUT16.P$1 SV9.11
N$32: BR15.P$1 CUT18.P$1 SV9.1
N$33: CUT17.P$1 SV9.3
N$34 [HV]: BR16.P$2 CUT19.P$2 SV10.12
N$35: BR17.P$2 CUT21.P$2 SV10.2
N$36: CUT20.P$2 SV10.4
N$37: CUT22.P$1 SV10.11
N$38: BR18.P$1 CUT24.P$1 SV10.1
N$39: CUT23.P$1 SV10.3
N$40 [HV]: BR23.P$2 CUT25.P$2 SV11.12
N$41: BR24.P$2 CUT27.P$2 SV11.2
N$42: CUT26.P$2 SV11.4
N$43: CUT28.P$1 SV11.11
N$44: BR25.P$1 CUT30.P$1 SV11.1
N$45 [HV]: BR28.P$2 CUT31.P$2 SV12.12
N$46: CUT29.P$1 SV11.3
N$47: BR29.P$2 CUT33.P$2 SV12.2
N$48: CUT32.P$2 SV12.4
N$49: CUT34.P$1 SV12.11
N$50: BR30.P$1 CUT36.P$1 SV12.1
N$51: CUT35.P$1 SV12.3
N$101 [medium power]: C20.1 D5.A J7.2 U3.3(IN)
N$104 [medium power]: D5.C D6.A
N$105 [medium power]: D6.C D7.A
Unconnected: J7.1

### Notes on the sheet
- P11 goes to
  DP Nixie cathode
  extra resistor
- HV comes
  in here
- Default = Nixie tubes
  Cut *ALL* CUT* traces and
  bridge all BR*, solder all
  resistors on this sheet and
  sort out 1V5 supply to get
  VFD configuration.
- This is actually +25V
  line in IV-11 (VFD) mode
- Turns out individual
  SMD resistors are WAY
  cheaper than arrays
- Use apropriate
  diodes to have a
  total voltage drop
  of Vf = 1.8 V @ 0.6 A
- Power connector
  from the logic board.
  +3V3 and +12V available
- Or use a 1.5 V SOT-223
  linear regulator with
  dropout Vf < 1.8 V @ 0.6 A

## Power pins joined to a net without a drawn wire
+: BAT1.+_2(+)

## Library data of the parts
BAT1 = nixe_cmp:CR2032: CR2032 universal battery holder This footprint should fit many different CR2032 battery holders such as this <http://www.memoryprotectiondevices.com/datasheets/BK-912-G-TR-datasheet.pdf>, this <http://www.memoryprotectiondevices.com/datasheets/BC-2003-datasheet.pdf> or this <http://www.memoryprotectiondevices.com/datasheets/BK-913-datasheet.pdf> both SMT and THT style.
BR1-BR36 = nixe_cmp:HV_SOLDER_BRIDGE: High voltage solder bridge jumper
C1-C4 C7 C8 C10 C11 C14-C18 C20 = rcl:C-EU: CAPACITOR, European symbol
C5 C6 C9 C12 C13 C19 = rcl:CPOL-EU: POLARIZED CAPACITOR, European symbol
CUT1-CUT36 = nixe_cmp:CUT_TRACE
D1 = diode:DIODE-: DIODE
D2 = nixe_cmp:BAS21: BAS21 200V diode General purpose 200V diode in SOT-23 package Datasheet: https://www.elfa.se/en/diode-sot-23-200-infineon-bas21/p/17030082
D3-D7 = nixe_cmp:B230A-13-F: Schottky Rectifier diode Datasheet <http://www.mouser.com/ds/2/115/ds13004-70120.pdf>; I_AVG: 2.0 A; I_FSM: 50 A; RMS_REV: 21 V; V_REV: 30 V
J1 J6 J7 = SparkFun-Connectors:CONN_03: Multi connection point. Often used as Generic Header-pin footprint for 0.1 inch spaced/style header connections On any of the 0.1 inch spaced packages, you can populate with these: Break Away Headers - Straight <https://www.sparkfun.com/products/116> (PRT-00116) Break Away Male Headers - Right Angle <https://www.sparkfun.com/products/553> (PRT-00553) Female Headers <https://www.sparkfun.com/products/115> (PRT-00115) Break Away Headers - Machine Pin <https://www.sparkfun.com/products/117> (PRT-00117) Break Away Female Headers - Swiss Machine Pin <https://www.sparkfun.com/products/743> (PRT-00743) Stackable Header - 3 Pin (Female, 0.1") <https://www.sparkfun.com/products/13875> (PRT-13875) For SCREWTERMINALS and SPRING TERMINALS visit here: Screw Terimnals on SparkFun.com <https://www.sparkfun.com/search/results?term=Screw+Terminals> (5mm/3.5mm/2.54mm spacing) This device is also useful as a general connection point to wire up your design to another part of your project. Our various solder wires solder well into these plated through hole pads. Hook-Up Wire - Assortment (Stranded, 22 AWG) <https://www.sparkfun.com/products/11375> (PRT-11375) Hook-Up Wire - Assortment (Solid Core, 22 AWG) <https://www.sparkfun.com/products/11367> (PRT-11367) View the entire wire category on our website here <https://www.sparkfun.com/categories/141> Special notes: Molex polarized connector foot print use with SKU : PRT-08232 with associated crimp pins and housings.
J2 J4 = nixe_cmp:RTC_CON
J3 = SparkFun-Connectors:CONN_06: Multi connection point. Often used as Generic Header-pin footprint for 0.1 inch spaced/style header connections On any of the 0.1 inch spaced packages, you can populate with these: Break Away Headers - Straight <https://www.sparkfun.com/products/116> (PRT-00116) Break Away Male Headers - Right Angle <https://www.sparkfun.com/products/553> (PRT-00553) Female Headers <https://www.sparkfun.com/products/115> (PRT-00115) Break Away Headers - Machine Pin <https://www.sparkfun.com/products/117> (PRT-00117) Break Away Female Headers - Swiss Machine Pin <https://www.sparkfun.com/products/743> (PRT-00743) Arduino Stackable Header - 6 Pin <https://www.sparkfun.com/products/9280> (PRT-09280) For SCREWTERMINALS and SPRING TERMINALS visit here: Screw Terimnals on SparkFun.com <https://www.sparkfun.com/search/results?term=Screw+Terminals> (5mm/3.5mm/2.54mm spacing) This device is also useful as a general connection point to wire up your design to another part of your project. Our various solder wires solder well into these plated through hole pads. Hook-Up Wire - Assortment (Stranded, 22 AWG) <https://www.sparkfun.com/products/11375> (PRT-11375) Hook-Up Wire - Assortment (Solid Core, 22 AWG) <https://www.sparkfun.com/products/11367> (PRT-11367) View the entire wire category on our website here <https://www.sparkfun.com/categories/141>; PROD_ID: CONN-08437
J5 = con-jack:JACK-PLUG: DC POWER JACK Power Jack, DC, Right Angle, Through Hole, Rated 5A at 16VDC, PC Terminals Distributor: Farnell (www.Farnell.de) Drawing: 84N1161.pdf / 84N1162.pdf Manufacturer: SPC Technology (www.spctechnology.com) Type: SPC4077 / SPC 4078; OC_FARNELL: unknown; OC_NEWARK: unknown
JP1 = PatternAgents-JTAG:JUMPER2: Jumper 2 Pin LBR Source: http://www.patternagents.com THIS SOFTWARE IS PROVIDED BY THE CONTRIBUTORS "AS IS" AND WITHOUT ANY EXPRESS OR IMPLIED WARRANTIES, INCLUDING, BUT NOT LIMITED TO, THE IMPLIED WARRANTIES OF MERCHANTABILITY AND FITNESS FOR A PARTICULAR PURPOSE ARE DISCLAIMED. IN NO EVENT SHALL THE COPYRIGHT OWNER OR CONTRIBUTORS BE LIABLE FOR ANY DIRECT, INDIRECT, INCIDENTAL, SPECIAL, EXEMPLARY, OR CONSEQUENTIAL DAMAGES (INCLUDING, BUT NOT LIMITED TO, PROCUREMENT OF SUBSTITUTE GOODS OR SERVICES; LOSS OF USE, DATA, OR PROFITS; OR BUSINESS INTERRUPTION) HOWEVER CAUSED AND ON ANY THEORY OF LIABILITY, WHETHER IN CONTRACT, STRICT LIABILITY, OR TORT (INCLUDING NEGLIGENCE OR OTHERWISE) ARISING IN ANY WAY OUT OF THE USE OF THIS SOFTWARE, EVEN IF ADVISED OF THE POSSIBILITY OF SUCH DAMAGE.
L1 L3 = nixe_cmp:HM78D-128151KLFTR: Inductor 150 uH 1.8A Datasheet: https://www.elfa.se/Web/Downloads/96/42/hm78_eng_tds.pdf?mime=application%2Fpdf Elfa: https://www.elfa.se/en/inductor-smd-150-uh-20-bi-technologies-hm78d-128151klftr/p/11039640?q=*&sort=Price:asc&filter_Category3=Ferrites+%2F+Inductors+%2F+Filters&filter_Category5=Inductors+%2F+Chokes%2C+SMD&filter_Category4=Inductors+%2F+Chokes&filter_Buyable=1&filter_Rated+inductance~~%C2%B5H=1000+%C2%B5H&filter_Rated+inductance~~%C2%B5H=1200+%C2%B5H&filter_Rated+inductance~~%C2%B5H=150+%C2%B5H&filter_Rated+inductance~~%C2%B5H=180+%C2%B5H&filter_Rated+inductance~~%C2%B5H=1800+%C2%B5H&filter_Rated+inductance~~%C2%B5H=2000+%C2%B5H&filter_Rated+inductance~~%C2%B5H=220+%C2%B5H&filter_Rated+inductance~~%C2%B5H=2200+%C2%B5H&filter_Rated+inductance~~%C2%B5H=248+%C2%B5H&filter_Rated+inductance~~%C2%B5H=250+%C2%B5H&filter_Rated+inductance~~%C2%B5H=256+%C2%B5H&filter_Rated+inductance~~%C2%B5H=270+%C2%B5H&filter_Rated+inductance~~%C2%B5H=2700+%C2%B5H&filter_Rated+inductance~~%C2%B5H=330+%C2%B5H&filter_Rated+inductance~~%C2%B5H=3300+%C2%B5H&filter_Rated+inductance~~%C2%B5H=377+%C2%B5H&filter_Rated+inductance~~%C2%B5H=383+%C2%B5H&filter_Rated+inductance~~%C2%B5H=390+%C2%B5H&filter_Rated+inductance~~%C2%B5H=3900+%C2%B5H&filter_Rated+inductance~~%C2%B5H=470+%C2%B5H&filter_Rated+inductance~~%C2%B5H=4700+%C2%B5H&filter_Rated+inductance~~%C2%B5H=560+%C2%B5H&filter_Rated+inductance~~%C2%B5H=6500+%C2%B5H&filter_Rated+inductance~~%C2%B5H=680+%C2%B5H&filter_Rated+inductance~~%C2%B5H=820+%C2%B5H&filter_Rated+current~~A=1.5+A&filter_Rated+current~~A=1.59+A&filter_Rated+current~~A=1.6+A&filter_Rated+current~~A=1.8+A&filter_Rated+current~~A=2.1+A&page=2&origPos=23&origPageSize=25&simi=97.1
N1-N6 = nixe_cmp:IN-14_IV-11_COMBI: Combination between IN-14 and IV-11 Russian tubes IN-14: medium numeric frontview nixie tube IV-11: Medium 7-segment frontview VFD tube
P1 P2 = nixe_cmp:UNIVERSAL-POTENTIOMETER_SMD
Q1 Q3 = nixe_cmp:BC856B: General purpose PNP transistor Datasheet: https://www.elfa.se/Web/Downloads/7x/_e/vfBC856x-to-BC857x_e.pdf?mime=application%2Fpdf
Q4 = nixe_cmp:BCX70H: General purpose NPN Transistor Datasheet <http://www.mouser.com/ds/2/149/BCX70H-888661.pdf>; I_C: 200 mA; V_CBO: 45 V; V_CEO: 45 V; V_EBO: 5 V
Q5 = nixe_cmp:NTF5P03: General purpose P MOSFET Something like this <http://www.onsemi.com/pub/Collateral/NTF5P03T3-D.PDF>, or this <http://www.infineon.com/dgdl/Infineon-BSP171P-DS-v02_07-en.pdf?fileId=db3a30433b47825b013b6004f59a57fa>; I_DS_AVG: -1.1 A; I_DS_PK: -4 A; V_DS: < -14 V
R1-R7 R15-R20 R28-R31 R33-R35 R37-R84 = rcl:R-EU_: RESISTOR, European symbol
R8-R14 R21 R24-R27 R32 R36 = resistor:R-EU_: RESISTOR, European symbol
R22 R23 = eagle-ltspice:R: RESISTOR, European symbol; SPICEMODEL: NONE; SPICEPREFIX: R
S1-S6 = switch-omron:31-XX: OMRON SWITCH; MPN: B3F-3100; OC_FARNELL: 959704; OC_NEWARK: 36M3582
SV1-SV12 = con-lstb:MA06-2: PIN HEADER; OC_FARNELL: unknown; OC_NEWARK: unknown
T1 = nixe_cmp:PHOTO_TRANS: PHOTO TRANSISTOR
U1 = PatternAgents_RFmodules:ESP12E: ESP12E Module
U2 = nixe_cmp:MC7940: RTC module with optional battery backup BEWARE: M version of the part does have battery bakub, but N part DOES NOT have battery backup! Datasheet: http://ww1.microchip.com/downloads/en/DeviceDoc/20002292B.pdf; HAS_BATT: YES; VCC: 1.8-5.5V
U3 = nixe_cmp:VREG: Generic linear voltage regulator Most of them have the same pinout anyway...
U$1 U$2 = supertex:HV5522
U$3 U$4 = KwanSystems:BSS138DW: Transistor for bi-directional level-shifting See here <http://ics.nxp.com/support/documents/interface/pdf/an97055.pdf> for details . Two transistors in this package, can be used for two bidirectional channels.
U$5 U$18 = MC34063:MC34063
U$36 = nixe_cmp:IPN60R3K4CE_NMOS: High voltage N MOSFET Something like this <http://www.infineon.com/dgdl/Infineon-IPN60R3K4CE-DS-v02_00-EN.pdf?fileId=5546d46253f6505701547af659125b4d> or this <https://www.fairchildsemi.com/datasheets/FD/FDT3N40.pdf>.; I_D: >1.5 A; V_DS: >220 V
Y1 = nixe_cmp:ECS-.327-7-34B: 32 kHz Tuning fork Datasheet <http://www.ecsxtal.com/store/pdf/ecx-31b.pdf>; C_LOAD: 7 pf; ESR: 70 kOhm; FREQ: 32.768 kHz; F_TOL: +/- 20 ppm; PACKAGE: ECX-32B

## Net classes
0 default: width 0.203 mm, drill 0.5 mm, clearance 0.203 mm
1 Power: width 0.508 mm, drill 0.5 mm, clearance 0.203 mm
2 HV: width 0.254 mm, drill 0.5 mm, clearance 1 mm
3 medium power: width 0.508 mm, drill 0.5 mm, clearance 0.203 mm
4 smallish power: width 0.305 mm, drill 0.5 mm, clearance 0.203 mm